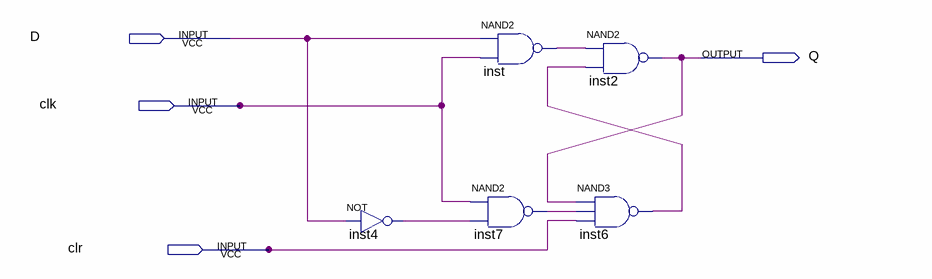
[diagram p0: schematic sheet]
// Quartus schematic dff_Q.bdf as structural Verilog: 5 symbols, 4 pins
module dff_Q (
  input  D,
  input  clk,
  input  clr,
  output Q
);

  wire inst4_out, inst6_out, inst7_out, inst_out;

  not inst4 (inst4_out, D);
  nand inst (inst_out, D, clk);
  nand inst7 (inst7_out, clk, inst4_out);
  nand inst2 (Q, inst_out, inst6_out);
  nand inst6 (inst6_out, Q, inst7_out, clr);
endmodule
